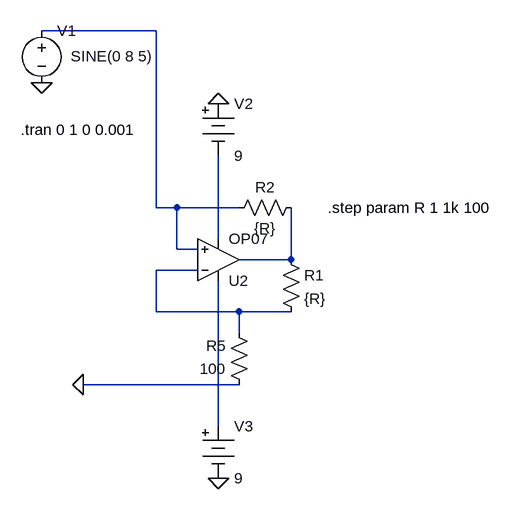
[diagram p0: schematic Draft2.asc]
Draft2.asc, the LTspice schematic file:
Version 4.1
SHEET 1 880 840
WIRE -48 128 -224 128
WIRE -48 400 -48 128
WIRE -16 400 -48 400
WIRE 80 400 -16 400
WIRE 48 448 48 320
WIRE -16 464 -16 400
WIRE 16 464 -16 464
WIRE 160 480 160 400
WIRE 160 480 80 480
WIRE 16 496 -48 496
WIRE -48 560 -48 496
WIRE 80 560 -48 560
WIRE 160 560 80 560
WIRE 80 592 80 560
WIRE 80 672 -160 672
WIRE 48 736 48 512
FLAG -224 208 0
FLAG -160 672 0
FLAG 48 816 0
FLAG 48 240 0
SYMBOL voltage -224 112 R0
WINDOW 3 45 55 Left 2
WINDOW 123 0 0 Left 0
WINDOW 39 0 0 Left 0
SYMATTR Value SINE(0 8 5)
SYMATTR InstName V1
SYMBOL OpAmps\\OP07 48 544 M180
SYMATTR InstName U2
SYMBOL res 96 688 R180
WINDOW 0 36 76 Left 2
WINDOW 3 36 40 Left 2
SYMATTR InstName R5
SYMATTR Value 100
SYMBOL Misc\\battery 48 224 R0
WINDOW 123 0 0 Left 0
WINDOW 39 0 0 Left 0
SYMATTR InstName V2
SYMATTR Value 9
SYMBOL Misc\\battery 48 720 R0
WINDOW 123 0 0 Left 0
WINDOW 39 0 0 Left 0
SYMATTR InstName V3
SYMATTR Value 9
SYMBOL res 144 464 R0
SYMATTR InstName R1
SYMATTR Value {R}
SYMBOL res 176 384 R90
WINDOW 0 0 56 VBottom 2
WINDOW 3 32 56 VTop 2
SYMATTR InstName R2
SYMATTR Value {R}
TEXT -256 280 Left 2 !.tran 0 1 0 0.001
TEXT 216 400 Left 2 !.step param R 1 1k 100

The netlist it stands for:
* Draft2.asc
V1 N001 0 SINE(0 8 5)
X§U2 N001 N004 N005 N002 N003 LT1001  ; OP07, pins In+ In- V+ V- OUT
R5 0 N004 100
V2 0 N002 9
V3 N005 0 9
R1 N003 N004 {R}
R2 N003 N001 {R}
.tran 0 1 0 0.001
.step param R 1 1k 100
.lib LTC.lib
.backanno
.end